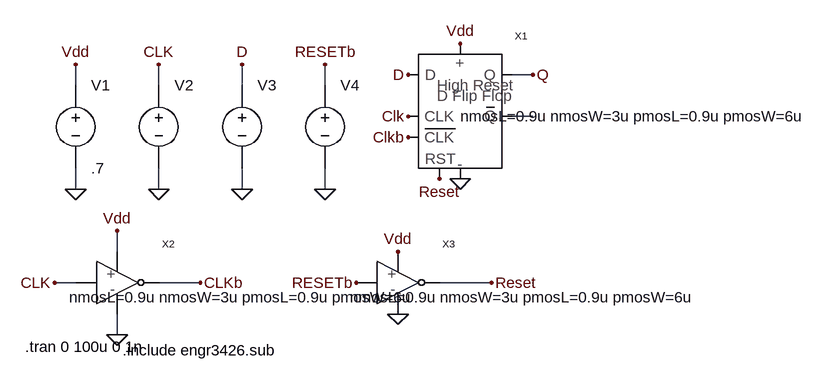
[diagram p0: schematic highResetFlipFlop_test.asc]
highResetFlipFlop_test.asc, the LTspice schematic file:
Version 4
SHEET 1 880 680
WIRE 304 112 272 112
WIRE -400 128 -400 96
WIRE -272 128 -272 96
WIRE -144 128 -144 96
WIRE -16 128 -16 96
WIRE 304 176 272 176
WIRE -400 288 -400 256
WIRE -272 288 -272 256
WIRE -144 288 -144 256
WIRE -16 288 -16 256
WIRE -336 384 -336 352
WIRE -400 432 -432 432
WIRE -208 432 -272 432
WIRE 240 432 160 432
WIRE -336 512 -336 480
FLAG 192 64 Vdd
FLAG 112 112 D
FLAG 112 176 Clk
FLAG 112 208 Clkb
FLAG 192 272 0
FLAG 304 112 Q
FLAG -400 288 0
FLAG -400 96 Vdd
FLAG -272 288 0
FLAG -272 96 CLK
FLAG -144 288 0
FLAG -144 96 D
FLAG -16 288 0
FLAG -16 96 RESETb
FLAG -336 512 0
FLAG -336 352 Vdd
FLAG -432 432 CLK
FLAG -208 432 CLKb
FLAG 160 272 Reset
FLAG 32 432 RESETb
FLAG 96 480 0
FLAG 96 384 Vdd
FLAG 240 432 Reset
SYMBOL highResetFlipFlop 192 176 R0
WINDOW 39 0 0 Left 2
SYMATTR InstName X1
SYMATTR SpiceLine nmosL=0.9u nmosW=3u pmosL=0.9u pmosW=6u
SYMBOL cktsym\\vsource -400 192 R0
WINDOW 123 0 0 Left 2
WINDOW 39 0 0 Left 2
SYMATTR Value .7
SYMATTR InstName V1
SYMBOL cktsym\\vsource -272 192 R0
WINDOW 3 48 16 Invisible 2
WINDOW 123 0 0 Left 2
WINDOW 39 0 0 Left 2
SYMATTR Value PULSE(0 .7 5u 1n 1n 10u 20u)
SYMATTR InstName V2
SYMBOL cktsym\\vsource -144 192 R0
WINDOW 3 48 16 Invisible 2
WINDOW 123 0 0 Left 2
WINDOW 39 0 0 Left 2
SYMATTR Value PULSE(0 .7 0.5u 1n 1n 20u 40u)
SYMATTR InstName V3
SYMBOL cktsym\\vsource -16 192 R0
WINDOW 3 48 12 Invisible 2
WINDOW 123 0 0 Left 2
WINDOW 39 0 0 Left 2
SYMATTR Value PWL(0 0 10u 0 10.05u .7 12u .7 12.05u 0 60u 0 60.01u .7 70u .7)
SYMATTR InstName V4
SYMBOL Inverter -336 432 R0
WINDOW 39 -74 22 Left 2
SYMATTR InstName X2
SYMATTR SpiceLine nmosL=0.9u nmosW=3u pmosL=0.9u pmosW=6u
SYMBOL Inverter 96 432 R0
WINDOW 39 -74 22 Left 2
SYMATTR InstName X3
SYMATTR SpiceLine nmosL=0.9u nmosW=3u pmosL=0.9u pmosW=6u
TEXT -478 530 Left 2 !.tran 0 100u 0 1n
TEXT -328 536 Left 2 !.include engr3426.sub

The netlist it stands for:
* highResetFlipFlop_test.asc
XX1 D Clk Clkb Q N001 Reset Vdd 0 highResetFlipFlop nmosL=0.9u nmosW=3u pmosL=0.9u pmosW=6u  ; pins D CLK CLKb Q Qb RESET pos neg
V1 Vdd 0 .7
V2 Clk 0 PULSE(0 .7 5u 1n 1n 10u 20u)
V3 D 0 PULSE(0 .7 0.5u 1n 1n 20u 40u)
V4 RESETb 0 PWL(0 0 10u 0 10.05u .7 12u .7 12.05u 0 60u 0 60.01u .7 70u .7)
XX2 Clk Clkb Vdd 0 Inverter nmosL=0.9u nmosW=3u pmosL=0.9u pmosW=6u  ; pins IN OUT pos neg
XX3 RESETb Reset Vdd 0 Inverter nmosL=0.9u nmosW=3u pmosL=0.9u pmosW=6u  ; pins IN OUT pos neg
.tran 0 100u 0 1n
.include engr3426.sub
.backanno
.end